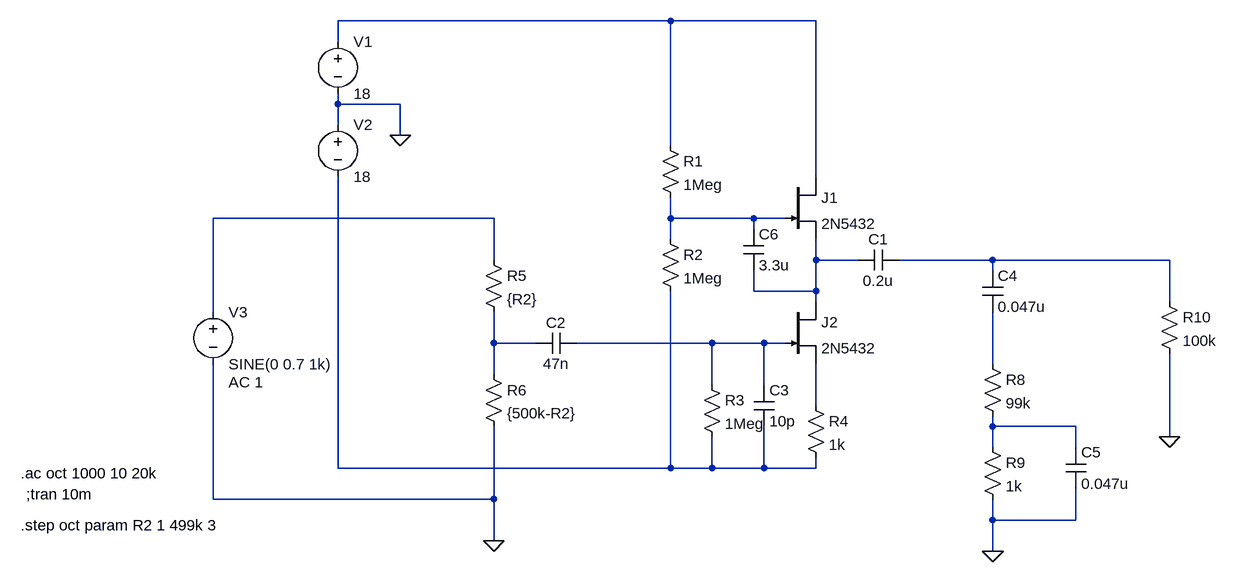
[diagram p0: schematic BB-1.asc]
BB-1.asc, the LTspice schematic file:
Version 4
SHEET 1 880 680
WIRE -16 -208 -528 -208
WIRE 208 -208 -16 -208
WIRE -528 -176 -528 -208
WIRE -528 -80 -528 -96
WIRE -432 -80 -528 -80
WIRE -528 -48 -528 -80
WIRE -432 -32 -432 -80
WIRE -16 -16 -16 -208
WIRE 208 32 208 -208
WIRE -288 96 -720 96
WIRE -16 96 -16 64
WIRE 112 96 -16 96
WIRE 160 96 112 96
WIRE 112 112 112 96
WIRE -16 128 -16 96
WIRE -288 160 -288 96
WIRE 208 160 208 128
WIRE 272 160 208 160
WIRE 480 160 336 160
WIRE 752 160 480 160
WIRE 480 176 480 160
WIRE 112 208 112 176
WIRE 208 208 208 160
WIRE 208 208 112 208
WIRE 208 224 208 208
WIRE 752 224 752 160
WIRE -720 240 -720 96
WIRE -288 288 -288 240
WIRE -224 288 -288 288
WIRE 48 288 -160 288
WIRE 128 288 48 288
WIRE 160 288 128 288
WIRE 480 320 480 240
WIRE -288 336 -288 288
WIRE 48 352 48 288
WIRE 128 352 128 288
WIRE 208 384 208 320
WIRE 480 416 480 400
WIRE 608 416 480 416
WIRE 752 432 752 304
WIRE 480 448 480 416
WIRE 608 448 608 416
WIRE -528 480 -528 32
WIRE -16 480 -16 208
WIRE -16 480 -528 480
WIRE 48 480 48 432
WIRE 48 480 -16 480
WIRE 128 480 128 416
WIRE 128 480 48 480
WIRE 208 480 208 464
WIRE 208 480 128 480
WIRE -720 528 -720 320
WIRE -288 528 -288 416
WIRE -288 528 -720 528
WIRE 480 560 480 528
WIRE 608 560 608 512
WIRE 608 560 480 560
WIRE -288 592 -288 528
WIRE 480 608 480 560
FLAG -432 -32 0
FLAG -288 592 0
FLAG 480 608 0
FLAG 752 432 0
SYMBOL njf 160 32 R0
SYMATTR InstName J1
SYMATTR Value 2N5432
SYMBOL njf 160 224 R0
SYMATTR InstName J2
SYMATTR Value 2N5432
SYMBOL res -32 -32 R0
SYMATTR InstName R1
SYMATTR Value 1Meg
SYMBOL res -32 112 R0
SYMATTR InstName R2
SYMATTR Value 1Meg
SYMBOL cap 336 144 R90
WINDOW 0 0 32 VBottom 2
WINDOW 3 32 32 VTop 2
SYMATTR InstName C1
SYMATTR Value 0.2u
SYMBOL cap -160 272 R90
WINDOW 0 0 32 VBottom 2
WINDOW 3 32 32 VTop 2
SYMATTR InstName C2
SYMATTR Value 47n
SYMBOL res 32 336 R0
SYMATTR InstName R3
SYMATTR Value 1Meg
SYMBOL cap 112 352 R0
SYMATTR InstName C3
SYMATTR Value 10p
SYMBOL res 192 368 R0
SYMATTR InstName R4
SYMATTR Value 1k
SYMBOL voltage -528 -192 R0
WINDOW 123 0 0 Left 2
WINDOW 39 0 0 Left 2
SYMATTR InstName V1
SYMATTR Value 18
SYMBOL voltage -528 -64 R0
WINDOW 123 0 0 Left 2
WINDOW 39 0 0 Left 2
SYMATTR InstName V2
SYMATTR Value 18
SYMBOL res -304 144 R0
SYMATTR InstName R5
SYMATTR Value {R2}
SYMBOL res -304 320 R0
SYMATTR InstName R6
SYMATTR Value {500k-R2}
SYMBOL voltage -720 224 R0
WINDOW 123 24 124 Left 2
WINDOW 39 0 0 Left 2
SYMATTR Value2 AC 1
SYMATTR InstName V3
SYMATTR Value SINE(0 0.7 1k)
SYMBOL cap 464 176 R0
SYMATTR InstName C4
SYMATTR Value 0.047u
SYMBOL res 464 304 R0
SYMATTR InstName R8
SYMATTR Value 99k
SYMBOL cap 592 448 R0
SYMATTR InstName C5
SYMATTR Value 0.047u
SYMBOL res 464 432 R0
SYMATTR InstName R9
SYMATTR Value 1k
SYMBOL res 736 208 R0
SYMATTR InstName R10
SYMATTR Value 100k
SYMBOL cap 96 112 R0
SYMATTR InstName C6
SYMATTR Value 3.3u
TEXT -1008 520 Left 2 !;tran 10m
TEXT -1016 488 Left 2 !.ac oct 1000 10 20k
TEXT -1016 568 Left 2 !.step oct param R2 1 499k 3

The netlist it stands for:
* BB-1.asc
J1 N001 N003 N004 2N5432
J2 N004 N007 N009 2N5432
R1 N001 N003 1Meg
R2 N003 N011 1Meg
C1 N005 N004 0.2u
C2 N007 N006 47n
R3 N007 N011 1Meg
C3 N007 N011 10p
R4 N009 N011 1k
V1 N001 0 18
V2 0 N011 18
R5 N002 N006 {R2}
R6 N006 0 {500k-R2}
V3 N002 0 SINE(0 0.7 1k) AC 1
C4 N005 N008 0.047u
R8 N008 N010 99k
C5 N010 0 0.047u
R9 N010 0 1k
R10 N005 0 100k
C6 N003 N004 3.3u
.model NJF NJF
.model PJF PJF
.lib standard.jft
;tran 10m
.ac oct 1000 10 20k
.step oct param R2 1 499k 3
.backanno
.end